# EAGLE schematic Heart Rate Headphones (EAGLE 9.0.1)
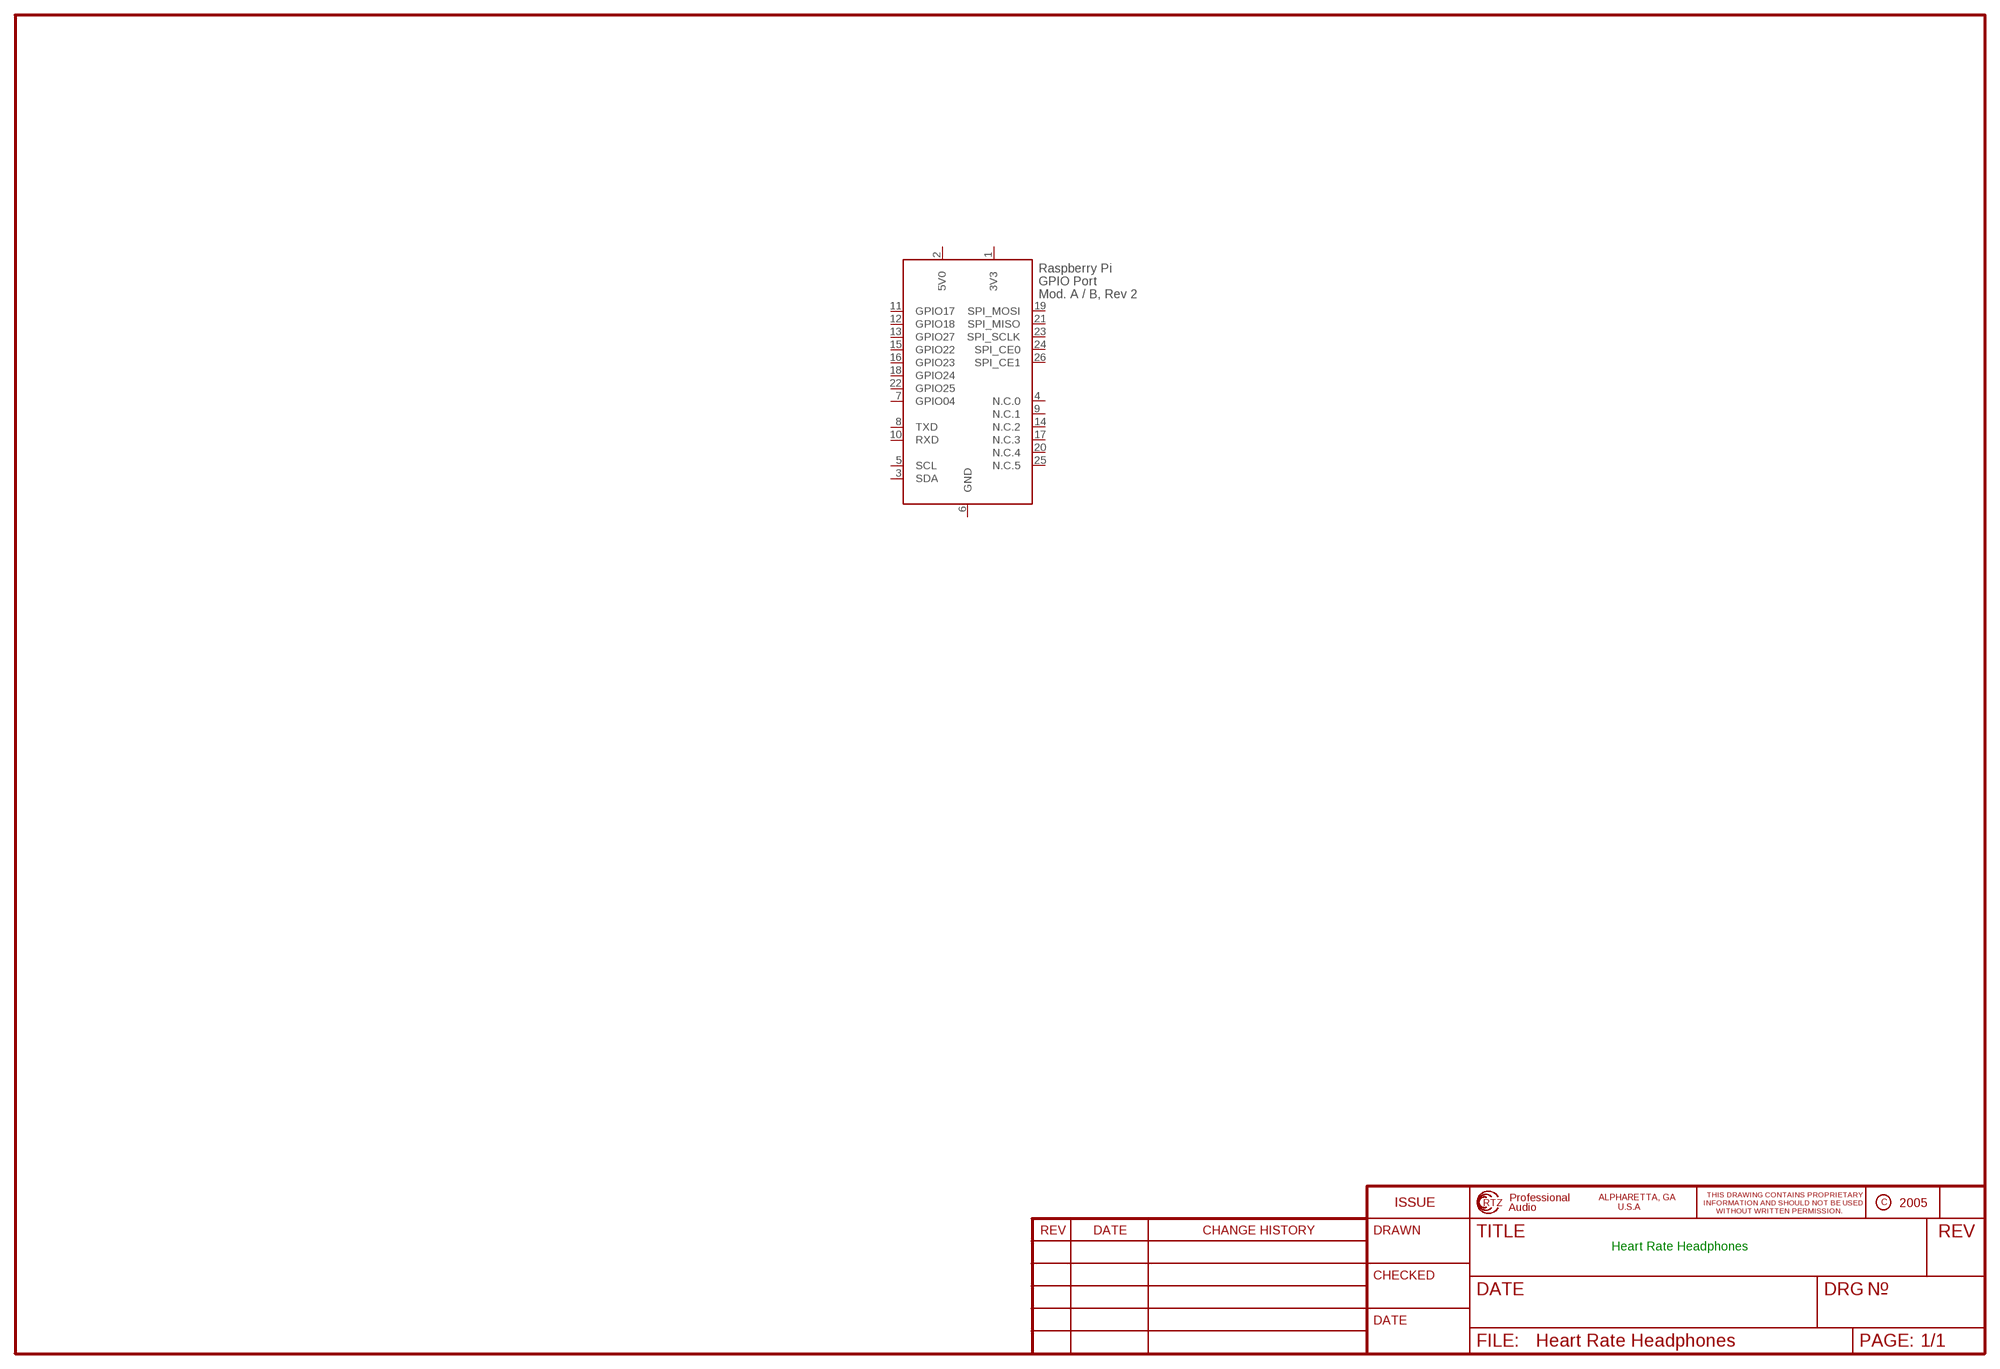
[diagram p0: schematic, sheet 1]

## Parts
X1  RASPI_BOARD_AB_F  [RASPI_BOARD_AB_FULL]
Unconnected: X1.3(SDA) X1.4(N.C.0) X1.5(SCL) X1.7(GPIO04) X1.8(TXD) X1.9(N.C.1) X1.10(RXD) X1.11(GPIO17) X1.12(GPIO18) X1.13(GPIO27) X1.14(N.C.2) X1.15(GPIO22) X1.16(GPIO23) X1.17(N.C.3) X1.18(GPIO24) X1.19(SPI_MOSI) X1.20(N.C.4) X1.21(SPI_MISO) X1.22(GPIO25) X1.23(SPI_SCLK) X1.24(SPI_CE0) X1.25(N.C.5) X1.26(SPI_CE1)

## Notes on the sheet
- Heart Rate Headphones

## Power pins joined to a net without a drawn wire
3V3: X1.1(3V3)
5V0: X1.2(5V0)
GND: X1.6(GND)

## Library data of the parts
X1 = raspberrypi_bastelstube_v13:RASPI_BOARD_AB: Raspberry Pi GPIO connector with markings for the outer dimensions of the Raspberry Pi board model A or B with different sets of drill holes or mounting pads for model B Revision 2.0